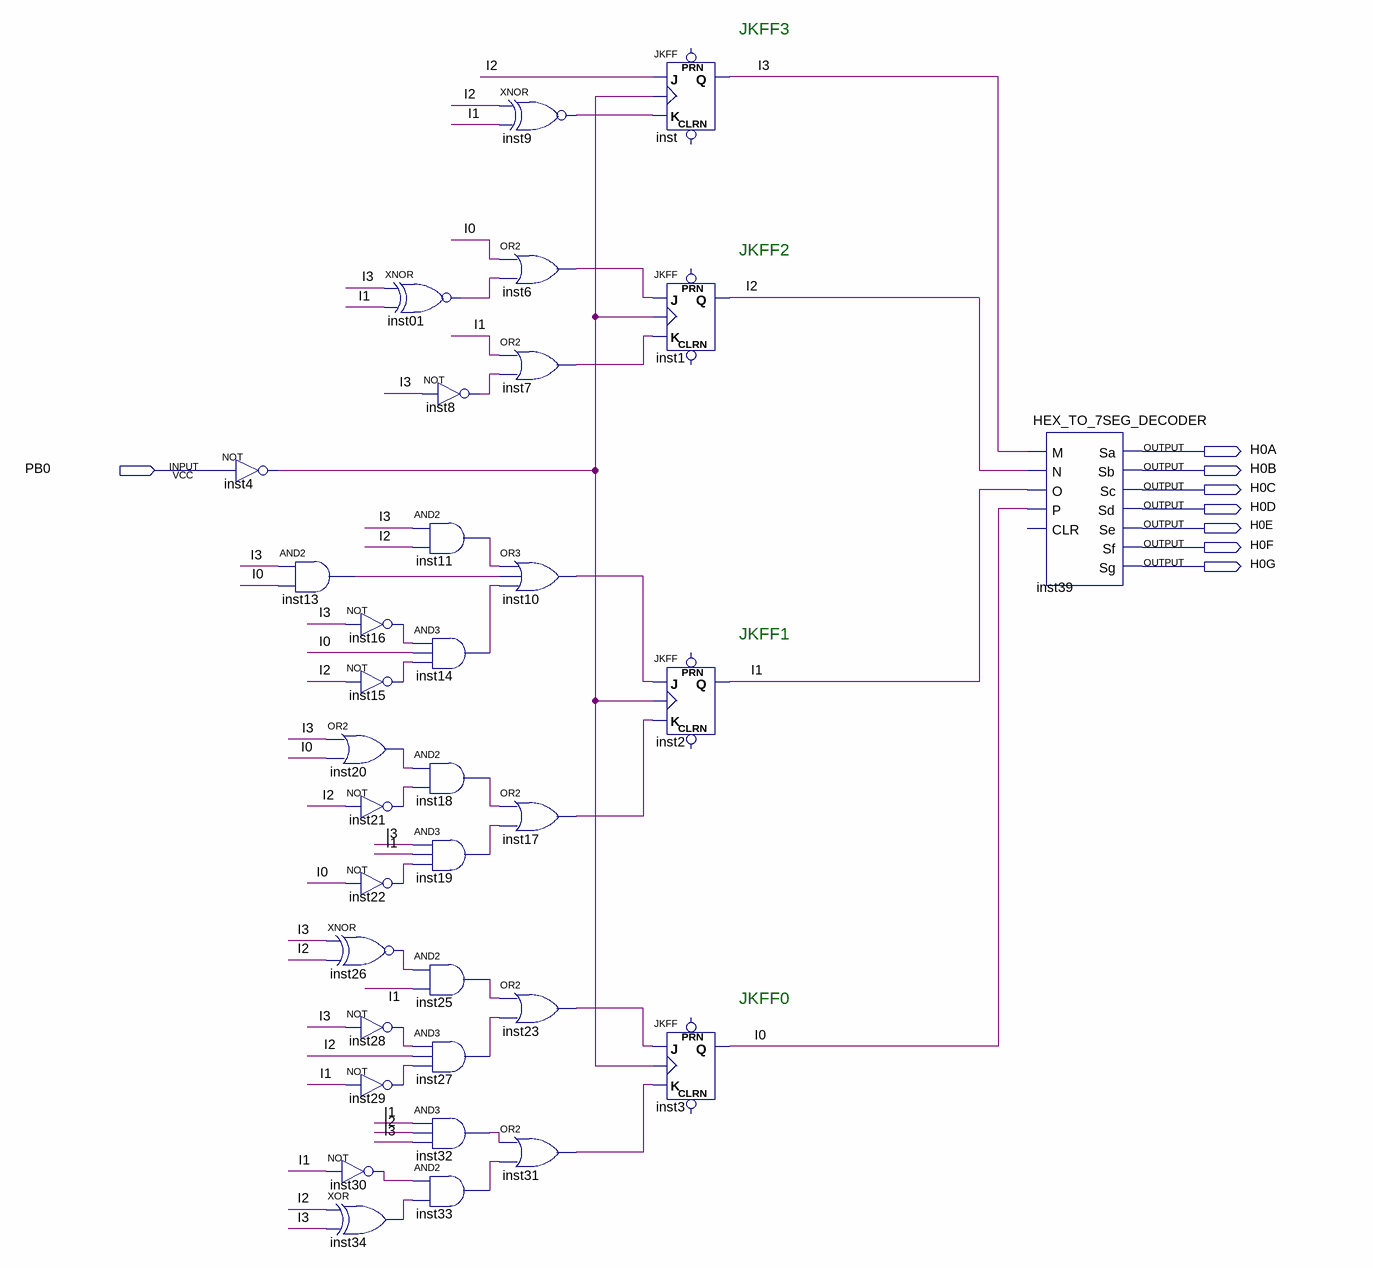
[diagram p0: schematic sheet]
// Quartus schematic main.bdf as structural Verilog: 34 symbols, 8 pins
module main (
  input  PB0,
  output H0A,
  output H0B,
  output H0C,
  output H0D,
  output H0E,
  output H0F,
  output H0G
);

  wire I0, I1, I2, I3, inst01_out, inst4_out, inst6_out, inst7_out, inst8_out, inst9_out, inst10_out,
       inst11_out, inst13_out, inst14_out, inst15_out, inst16_out, inst17_out, inst18_out, inst19_out,
       inst20_out, inst21_out, inst22_out, inst23_out, inst25_out, inst26_out, inst27_out, inst28_out,
       inst29_out, inst30_out, inst31_out, inst32_out, inst33_out, inst34_out;

  not inst4 (inst4_out, PB0);
  and inst13 (inst13_out, I3, I0);
  or inst20 (inst20_out, I3, I0);
  xnor inst26 (inst26_out, I3, I2);
  not inst30 (inst30_out, I1);
  xor inst34 (inst34_out, I2, I3);
  xnor inst01 (inst01_out, I3, I1);
  and inst11 (inst11_out, I3, I2);
  not inst16 (inst16_out, I3);
  and inst14 (inst14_out, inst16_out, I0, inst15_out);
  not inst15 (inst15_out, I2);
  and inst18 (inst18_out, inst20_out, inst21_out);
  not inst21 (inst21_out, I2);
  and inst19 (inst19_out, I3, I1, inst22_out);
  not inst22 (inst22_out, I0);
  and inst25 (inst25_out, inst26_out, I1);
  not inst28 (inst28_out, I3);
  and inst27 (inst27_out, inst28_out, I2, inst29_out);
  not inst29 (inst29_out, I1);
  and inst32 (inst32_out, I1, I2, I3);
  and inst33 (inst33_out, inst30_out, inst34_out);
  not inst8 (inst8_out, I3);
  xnor inst9 (inst9_out, I2, I1);
  or inst6 (inst6_out, I0, inst01_out);
  or inst7 (inst7_out, I1, inst8_out);
  or inst10 (inst10_out, inst11_out, inst13_out, inst14_out);
  or inst17 (inst17_out, inst18_out, inst19_out);
  or inst23 (inst23_out, inst25_out, inst27_out);
  or inst31 (inst31_out, inst32_out, inst33_out);
  JKFF inst (.K(inst9_out), .J(I2), .CLK(inst4_out), .Q(I3));  // open: PRN, CLRN
  JKFF inst1 (.K(inst7_out), .J(inst6_out), .CLK(inst4_out), .Q(I2));  // open: PRN, CLRN
  JKFF inst2 (.K(inst17_out), .J(inst10_out), .CLK(inst4_out), .Q(I1));  // open: PRN, CLRN
  JKFF inst3 (.K(inst31_out), .J(inst23_out), .CLK(inst4_out), .Q(I0));  // open: PRN, CLRN
  HEX_TO_7SEG_DECODER inst39 (
    .M(I3), .N(I2), .O(I1), .P(I0), .Sa(H0A), .Sb(H0B), .Sc(H0C), .Sd(H0D), .Se(H0E), .Sf(H0F), .Sg(H0G));  // open: CLR

  // Notes on the sheet:
  //   JKFF3
  //   JKFF2
  //   JKFF1
  //   JKFF0
endmodule
